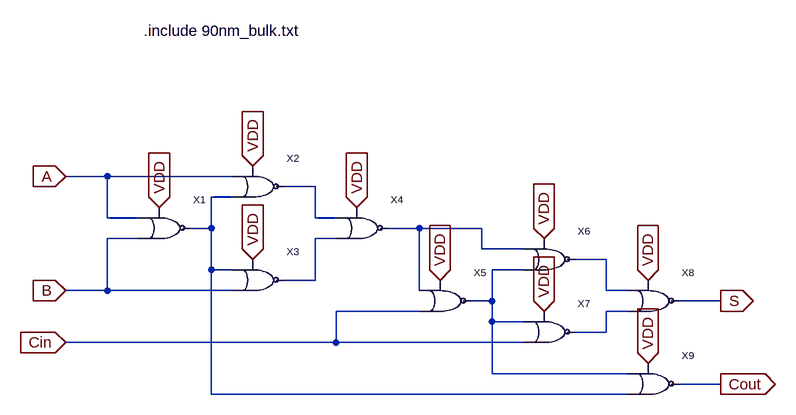
[diagram p0: schematic full_adder.asc]
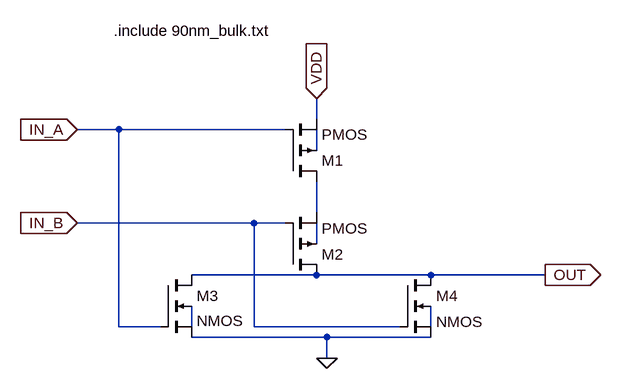
[diagram p1: sub-circuit nor.asc]
full_adder.asc, the LTspice schematic file:
Version 4
SHEET 1 880 680
WIRE -464 0 -528 0
WIRE -272 0 -464 0
WIRE -144 16 -192 16
WIRE -272 32 -304 32
WIRE -464 64 -464 0
WIRE -416 64 -464 64
WIRE -144 64 -144 16
WIRE -112 64 -144 64
WIRE -304 80 -304 32
WIRE -304 80 -336 80
WIRE 16 80 -32 80
WIRE 112 80 16 80
WIRE -416 96 -464 96
WIRE -112 96 -144 96
WIRE 112 112 112 80
WIRE 176 112 112 112
WIRE 304 128 256 128
WIRE -304 144 -304 80
WIRE -272 144 -304 144
WIRE 176 144 128 144
WIRE -144 160 -144 96
WIRE -144 160 -192 160
WIRE -464 176 -464 96
WIRE -464 176 -528 176
WIRE -272 176 -464 176
WIRE 16 176 16 80
WIRE 304 176 304 128
WIRE 336 176 304 176
WIRE 128 192 128 144
WIRE 128 192 96 192
WIRE 480 192 416 192
WIRE 16 208 -112 208
WIRE 336 208 304 208
WIRE 128 224 128 192
WIRE 176 224 128 224
WIRE 304 240 304 208
WIRE 304 240 256 240
WIRE -112 256 -112 208
WIRE -112 256 -528 256
WIRE 176 256 -112 256
WIRE 128 304 128 224
WIRE 336 304 128 304
WIRE 480 320 416 320
WIRE -304 336 -304 144
WIRE 336 336 -304 336
FLAG -528 0 A
IOPIN -528 0 In
FLAG -528 176 B
IOPIN -528 176 In
FLAG -528 256 Cin
IOPIN -528 256 In
FLAG 480 192 S
IOPIN 480 192 Out
FLAG 480 320 Cout
IOPIN 480 320 Out
FLAG -384 48 VDD
IOPIN -384 48 In
FLAG -240 -16 VDD
IOPIN -240 -16 In
FLAG -240 128 VDD
IOPIN -240 128 In
FLAG -80 48 VDD
IOPIN -80 48 In
FLAG 48 160 VDD
IOPIN 48 160 In
FLAG 208 96 VDD
IOPIN 208 96 In
FLAG 208 208 VDD
IOPIN 208 208 In
FLAG 368 160 VDD
IOPIN 368 160 In
FLAG 368 288 VDD
IOPIN 368 288 In
SYMBOL nor -384 80 R0
SYMATTR InstName X1
SYMBOL nor -240 16 R0
SYMATTR InstName X2
SYMBOL nor -240 160 R0
SYMATTR InstName X3
SYMBOL nor -80 80 R0
SYMATTR InstName X4
SYMBOL nor 48 192 R0
SYMATTR InstName X5
SYMBOL nor 208 128 R0
SYMATTR InstName X6
SYMBOL nor 208 240 R0
SYMATTR InstName X7
SYMBOL nor 368 192 R0
SYMATTR InstName X8
SYMBOL nor 368 320 R0
SYMATTR InstName X9
TEXT -408 -224 Left 2 !.include 90nm_bulk.txt

nor.asc, the sub-circuit schematic file:
Version 4
SHEET 1 880 680
WIRE 144 80 144 48
WIRE -160 96 -224 96
WIRE 96 96 -160 96
WIRE 144 128 144 96
WIRE 144 224 144 176
WIRE 48 240 -224 240
WIRE 96 240 48 240
WIRE 144 272 144 240
WIRE 144 320 -48 320
WIRE 320 320 144 320
WIRE 496 320 320 320
WIRE -160 400 -160 96
WIRE -96 400 -160 400
WIRE -48 400 -48 368
WIRE 48 400 48 240
WIRE 272 400 48 400
WIRE 320 400 320 368
WIRE 160 416 -48 416
WIRE 320 416 160 416
WIRE 160 448 160 416
FLAG 160 448 0
FLAG -224 96 IN_A
IOPIN -224 96 In
FLAG -224 240 IN_B
IOPIN -224 240 In
FLAG 144 48 VDD
IOPIN 144 48 In
FLAG 496 320 OUT
IOPIN 496 320 Out
SYMBOL pmos4 96 176 M180
SYMATTR InstName M1
SYMATTR Value2 l=90n w=400n
SYMBOL pmos4 96 320 M180
SYMATTR InstName M2
SYMATTR Value2 l=90n w=400n
SYMBOL nmos4 -96 320 R0
WINDOW 3 56 71 Left 2
SYMATTR InstName M3
SYMATTR Value2 l=90n w=200n
SYMBOL nmos4 272 320 R0
SYMATTR InstName M4
SYMATTR Value2 l=90n w=200n
TEXT -168 -56 Left 2 !.include 90nm_bulk.txt

The netlist it stands for:
* full_adder.asc
XX1 A B N002 VDD nor
XX2 A N002 N001 VDD nor
XX3 N002 B N004 VDD nor
XX4 N001 N004 N003 VDD nor
XX5 N003 Cin N006 VDD nor
XX6 N003 N006 N005 VDD nor
XX7 N006 Cin N007 VDD nor
XX8 N005 N007 S VDD nor
XX9 N006 N002 Cout VDD nor

* block symbol definitions
.subckt nor IN_A IN_B OUT VDD
M1 N002 IN_A VDD N001 PMOS l=90n w=400n
M2 OUT IN_B N002 N003 PMOS l=90n w=400n
M3 OUT IN_A 0 N004 NMOS l=90n w=200n
M4 OUT IN_B 0 N005 NMOS l=90n w=200n
.include 90nm_bulk.txt
.ends nor

.model NMOS NMOS
.model PMOS PMOS
.lib standard.mos
.include 90nm_bulk.txt
.backanno
.end